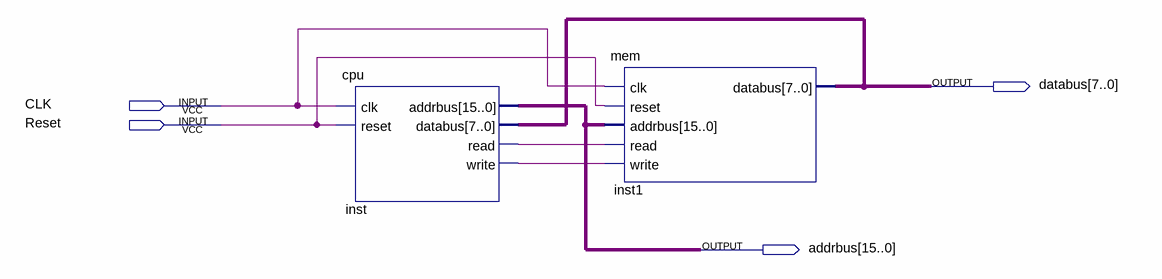
[diagram p0: schematic sheet]
// Quartus schematic comp.bdf as structural Verilog: 2 symbols, 4 pins
module comp (
  input  CLK,
  input  Reset,
  output [7:0] databus,
  output [15:0] addrbus
);

  wire inst_read, inst_write;

  cpu inst (.clk(CLK), .reset(Reset), .addrbus(addrbus), .read(inst_read), .write(inst_write), .databus(databus));
  mem inst1 (.clk(CLK), .reset(Reset), .addrbus(addrbus), .read(inst_read), .write(inst_write), .databus(databus));
endmodule
